# EAGLE design 403_led_bar (EAGLE 9.6.2)
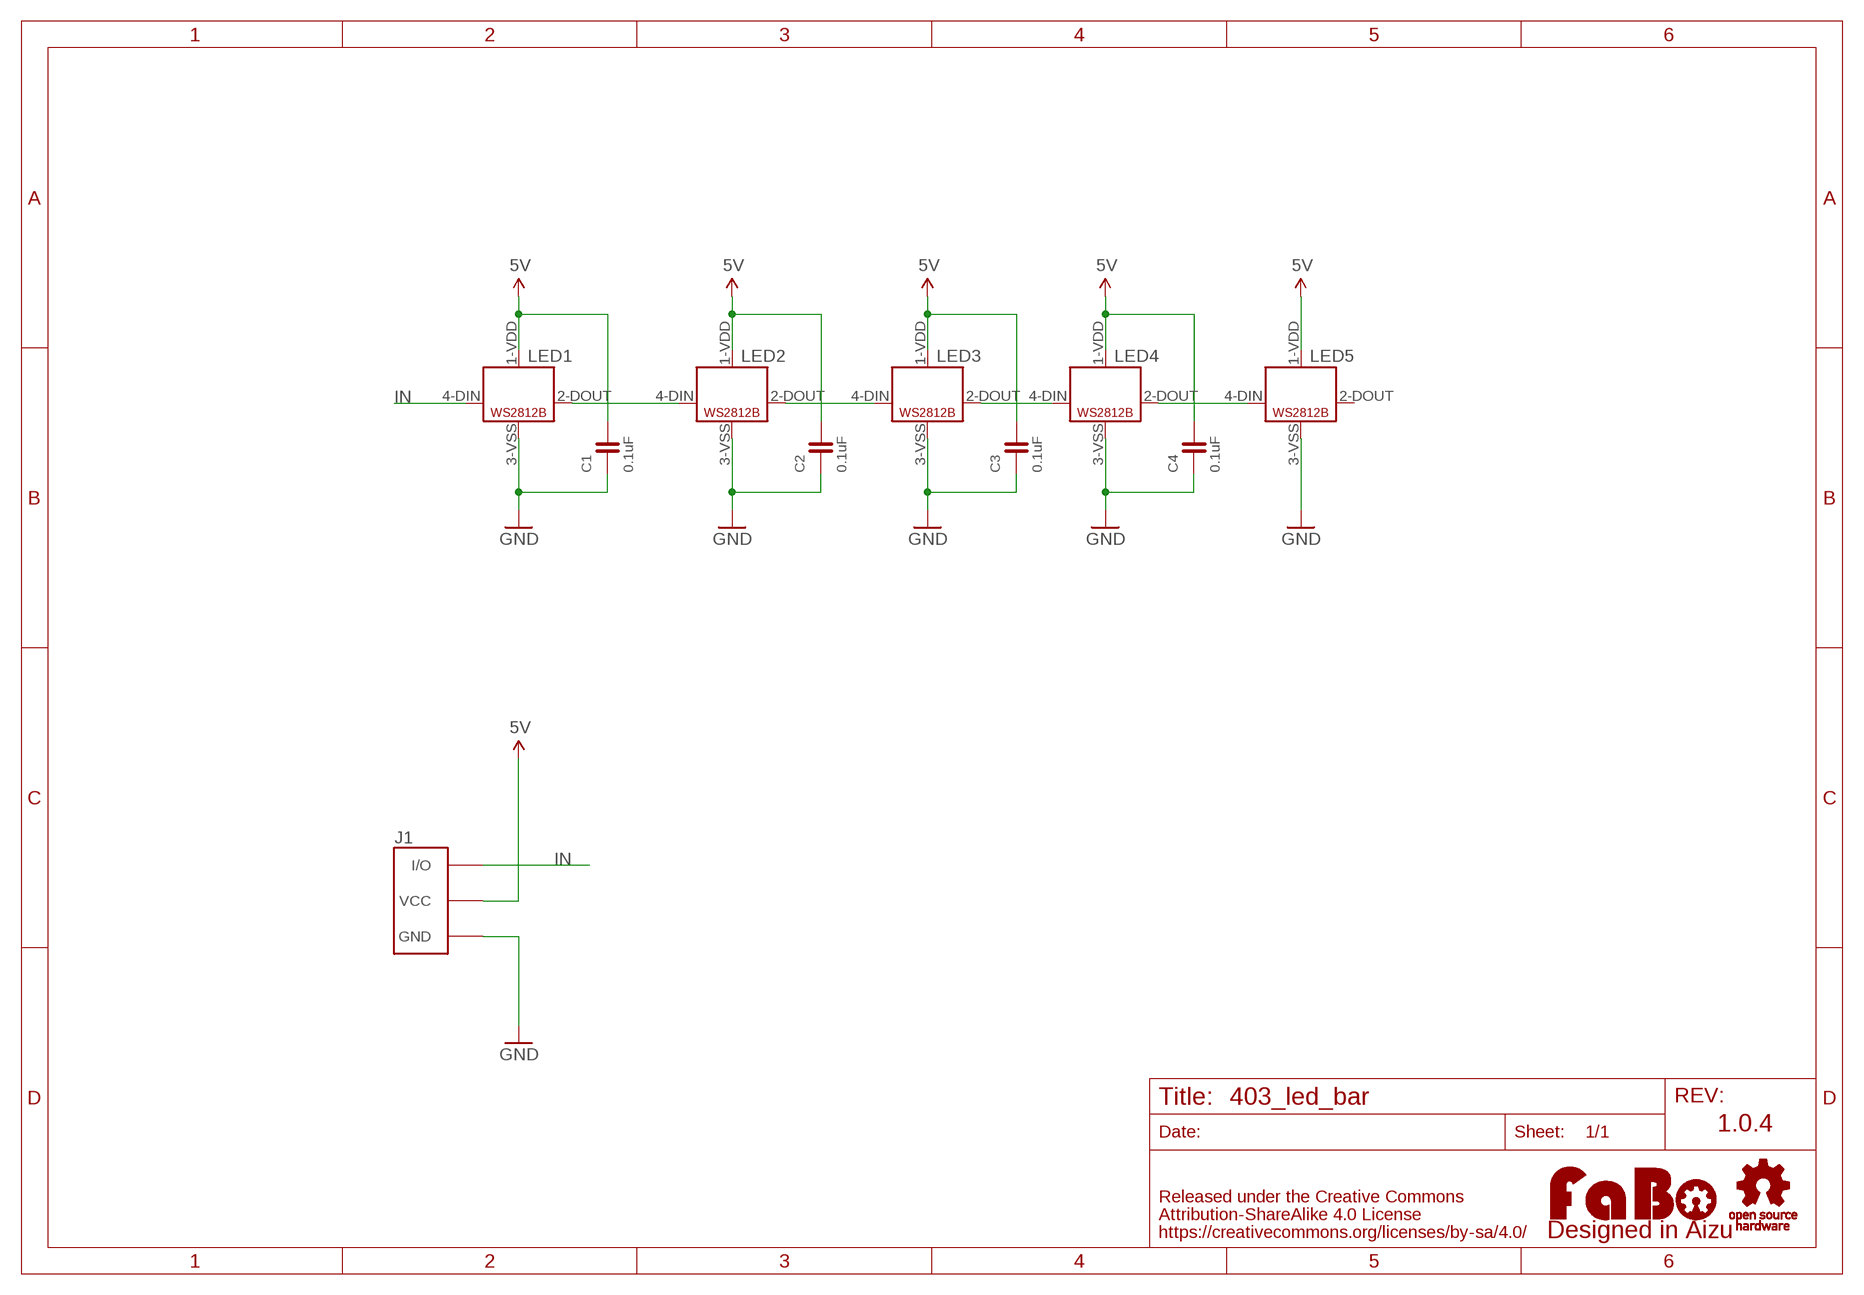
[diagram p0: schematic, sheet 1]

## Parts
C1  0.1uF  CAPACITOR-0603_NARROW  [0603-NARROW]
C2  0.1uF  CAPACITOR-0603_NARROW  [0603-NARROW]
C3  0.1uF  CAPACITOR-0603_NARROW  [0603-NARROW]
C4  0.1uF  CAPACITOR-0603_NARROW  [0603-NARROW]
J1  FABO_BRICK_3PIN-S03B-PASK-2_LONG  [FABO_BRICK_3PIN_S03B-PASK-2_LONG]
LED1  WS2812B_NARROW  [WS2812B_NARROW]
LED2  WS2812B_NARROW  [WS2812B_NARROW]
LED3  WS2812B_NARROW  [WS2812B_NARROW]
LED4  WS2812B_NARROW  [WS2812B_NARROW]
LED5  WS2812B_NARROW  [WS2812B_NARROW]
LOGO1  LOGO_FABO-M_BOTTOM  [LOGO_FABO_M_BOTTOM]
U$2  LOGO_OSHW-M_BOTTOM  [LOGO_OSHW_M_BOTTOM]

## Nets
5V: C1.2 C2.2 C3.2 C4.2 J1.VCC LED1.1-VDD(VDD) LED2.1-VDD(VDD) LED3.1-VDD(VDD) LED4.1-VDD(VDD) LED5.1-VDD(VDD)
GND: C1.1 C2.1 C3.1 C4.1 J1.GND LED1.3-VSS(VSS) LED2.3-VSS(VSS) LED3.3-VSS(VSS) LED4.3-VSS(VSS) LED5.3-VSS(VSS)
IN: J1.I/O LED1.4-DIN(DIN)
N$3: LED1.2-DOUT(DOUT) LED2.4-DIN(DIN)
N$6: LED2.2-DOUT(DOUT) LED3.4-DIN(DIN)
N$8: LED3.2-DOUT(DOUT) LED4.4-DIN(DIN)
N$9: LED4.2-DOUT(DOUT) LED5.4-DIN(DIN)
Unconnected: LED5.2-DOUT(DOUT)

## Notes on the sheet
- 1.0.4

## Library data of the parts
C1-C4 = FaBo-Capacitor:CAPACITOR: CAPACITOR
J1 = FaBo-Template:FABO_BRICK_3PIN: FaBo Brick 3pin
LED1-LED5 = FaBo-LED:WS2812B_NARROW
LOGO1 = component:LOGO_FABO
U$2 = FaBo-etc:LOGO_OSHW

## Board
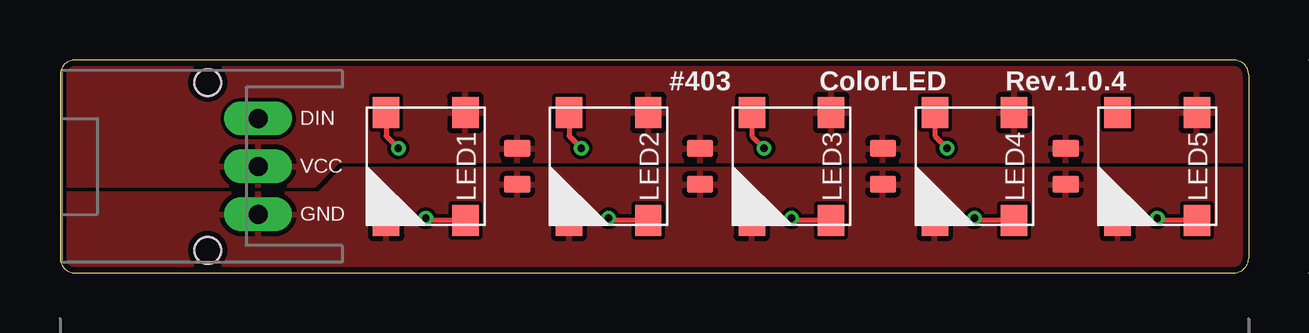
[diagram p1: board, top side]
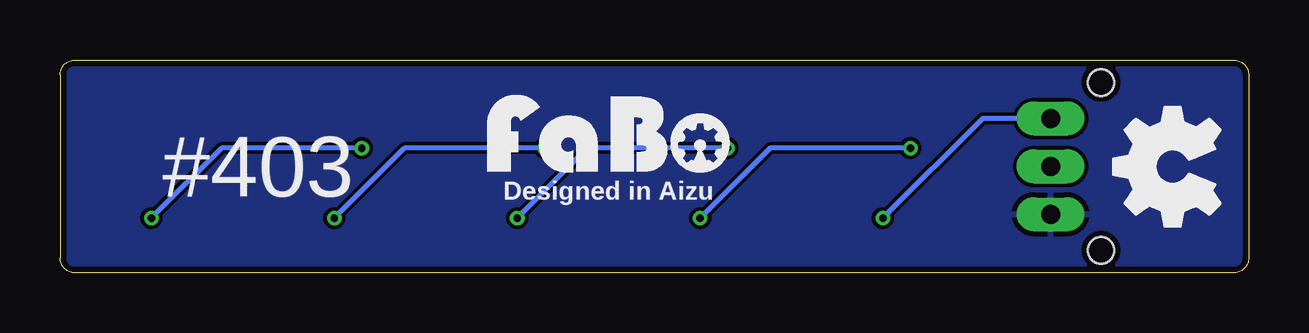
[diagram p2: board, bottom side, seen from below]

Size 49.53 x 8.89 mm. Coordinates in mm from the lower left corner, seen from the top.
Outline: 0.64,0 48.9,0 arc90 49.53,0.64 49.53,8.26 arc90 48.9,8.89 0.64,8.89 arc90 0,8.26 0,0.64 arc90 0.64,0
Copper layers (1*16): Top 0.035mm / dielectric 1.6mm / Bottom 0.035mm
Design rules "PCBway": minimum track width 6mil, minimum drill 12mil, track to track 6mil, track to pad 6mil, pad to pad 6mil, via to via 6mil, smd to smd 6mil, copper to edge 10mil, drill to drill 10mil, minimum pad ring 10mil, minimum via ring 6mil, stop-mask expansion 2mil, vias tented up to drill 100mil, thermal gap 8mil

### Footprints (pad centres in the part's own frame; a part is rotated, then mirrored left to right if it is on the bottom)
0603-NARROW = smd 0.71 x 1.09: 1 -0.75,0; 2 0.75,0
FABO_BRICK_3PIN_S03B-PASK-2_LONG = drill 0.8 pad 1.422 long: GND -2,0; I/O 2,0; VCC 0,0 | hole 1.1: 3.5,2.1; -3.5,2.1
WS2812B_NARROW = smd 1.3 x 1.1: 1-VDD -2.25,1.65; 2-DOUT -2.25,-1.65; 3-VSS 2.25,-1.65; 4-DIN 2.25,1.65

### Placement (x,y rotation side)
C1  19.05,4.45 90 top
C2  26.67,4.45 90 top
C3  34.29,4.45 90 top
C4  41.91,4.45 90 top
J1  8.26,4.45 90 top
LED1  15.24,4.45 270 top
LED2  22.86,4.45 270 top
LED3  30.48,4.45 270 top
LED4  38.1,4.45 270 top
LED5  45.72,4.45 270 top
LOGO1  26.67,3.81 0 top
U$2  3.17,4.45 270 top

### Tracks (layer width: path | path; a pad name or v marks a point on that pad's centre or on a via)
5V
  pour Top (rank 2): 0,8.89 0,3.3 10.79,3.3 11.81,4.32 49.53,4.32 49.53,8.89
GND
  pour Top: 0,0 49.53,0 49.53,4.32 11.81,4.32 10.79,3.3 0,3.3
  pour Bottom: 0,0 49.53,0 49.53,8.89 0,8.89
IN  (via drill 0.3)
  Top 0.203: LED1.4-DIN 15.33,2.19 v15.24,2.29
  Bottom 0.203: 14.99,2.54 v15.24,2.29 11.08,6.45 J1.I/O
N$3  (via drill 0.3)
  Top 0.203: LED2.4-DIN 22.95,2.19 v22.86,2.29 | LED1.2-DOUT 13.59,5.71 v14.1,5.21
  Bottom 0.203: v14.1,5.21 19.94,5.21 v22.86,2.29
N$6  (via drill 0.3)
  Top 0.203: LED3.4-DIN 30.57,2.19 v30.48,2.29 | LED2.2-DOUT 21.21,5.71 v21.72,5.21
  Bottom 0.203: v21.72,5.21 27.56,5.21 v30.48,2.29
N$8  (via drill 0.3)
  Top 0.203: LED3.2-DOUT 28.83,5.71 v29.34,5.21 | LED4.4-DIN 38.19,2.19 v38.1,2.29
  Bottom 0.203: v29.34,5.21 35.18,5.21 v38.1,2.29
N$9  (via drill 0.3)
  Top 0.203: LED4.2-DOUT 36.45,5.71 v36.96,5.21 | LED5.4-DIN 45.81,2.19 v45.72,2.29
  Bottom 0.203: v36.96,5.21 42.8,5.21 v45.72,2.29

### Text on the board
tPlace: #403 | ColorLED | Rev.1.0.4 | DIN | VCC | GND
bPlace: Designed in Aizu | #403